# Altium schematic sheet UARTRecoder.SchDoc
size A3
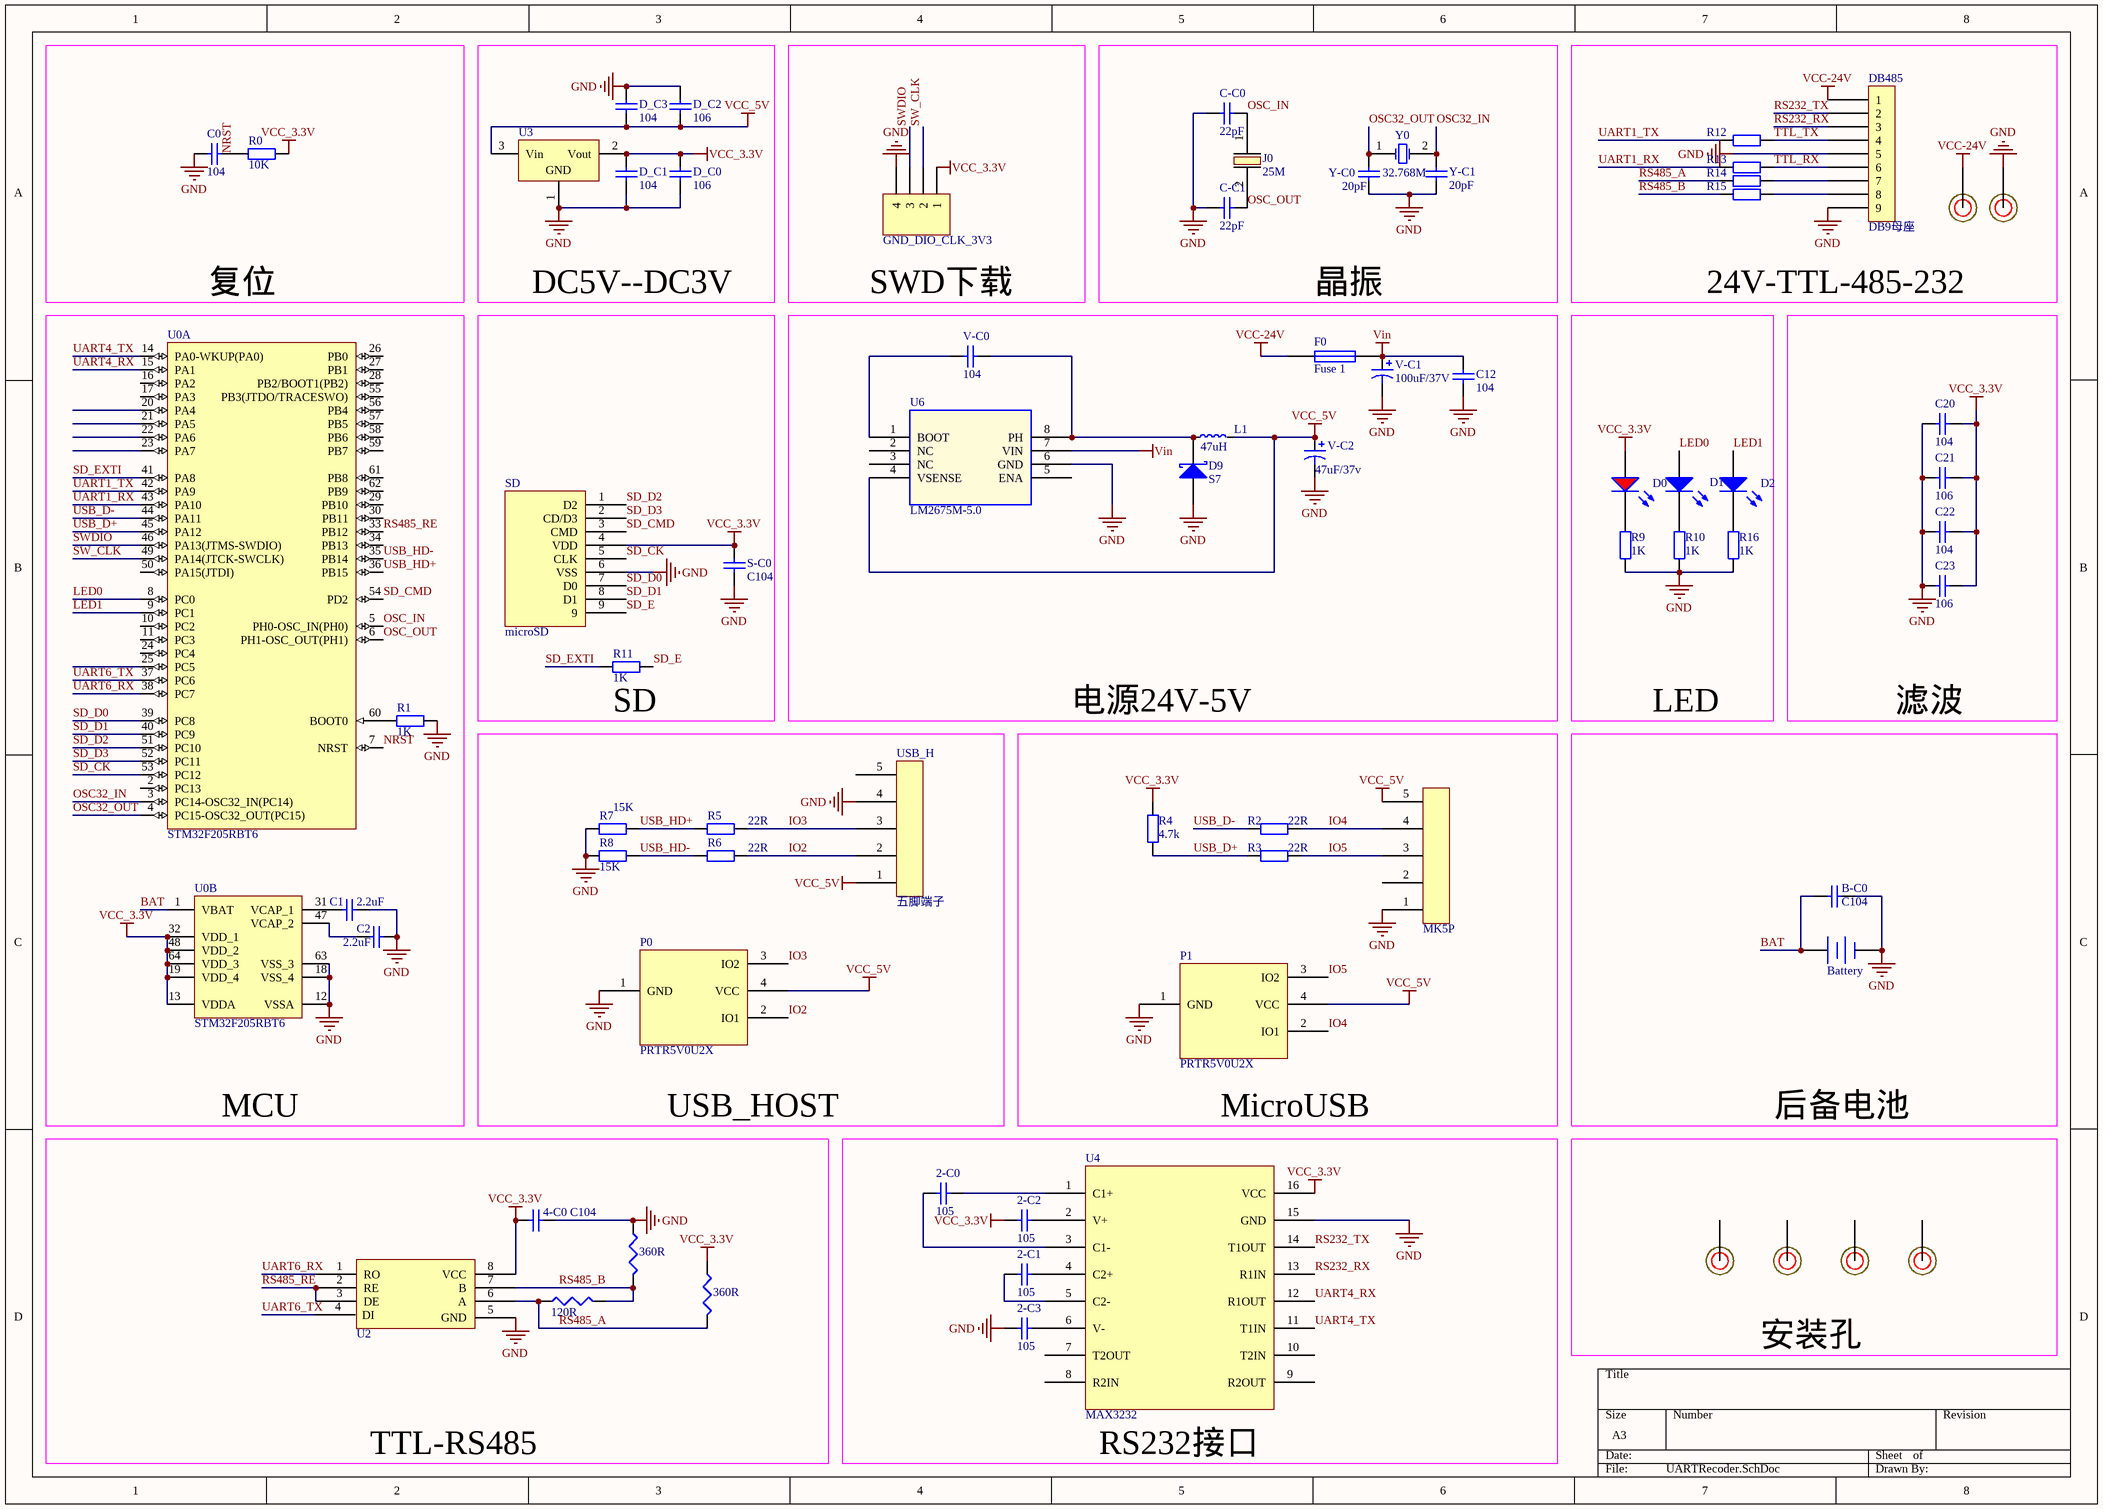
[diagram p0: UARTRecoder.SchDoc]

## Parts
2-C0  105  [C-RAD-0805]
2-C1  105  [C-RAD-0805]
2-C2  105  [C-RAD-0805]
2-C3  105  [C-RAD-0805]
4-C0  C104  [C-RAD-0805]
4-R0  value 360R  [R2012-0805]  (hidden comment: R360)
4-R1  value 360R  [R2012-0805]  (hidden comment: R360)
4-R2  value 120R  [R2012-0805]  (hidden comment: R120)
24V  1孔  [HOLEx1]  (value not drawn)
B-C0  C104  [C-RAD-0805]
bat  Battery  [BATM]
C0  104  [C-RAD-0805]
C1  2.2uF  [C-RAD-0805]
C2  2.2uF  [C-RAD-0805]
C12  104  [C-RAD-0805]
C20  104  [C-RAD-0805]
C21  106  [C-RAD-0805]
C22  104  [C-RAD-0805]
C23  106  [C-RAD-0805]
C-C0  22pF  [C-RAD-0805]
C-C1  22pF  [C-RAD-0805]
D0  Rled  [0805_LED_S1]  (value not drawn)
D1  Bled  [0805_LED_S1]  (value not drawn)
D2  Bled  [0805_LED_S1]  (value not drawn)
D9  S7  [SOD123]
D_C0  106  [C-RAD-0805]
D_C1  104  [C-RAD-0805]
D_C2  106  [C-RAD-0805]
D_C3  104  [C-RAD-0805]
DB485  DB9母座  [DB9-F]
EGND0  1孔  [HOLEx1]  (value not drawn)
EGND1  1孔  [HOLEx1]  (value not drawn)
EGND2  1孔  [HOLEx1]  (value not drawn)
EGND3  1孔  [HOLEx1]  (value not drawn)
F0  Fuse 1  [1812]
GND  1孔  [HOLEx1]  (value not drawn)
GND_DIO_CLK_3V3  Header 4  [HDR1X4]  (value not drawn)
J0  25M  [晶振HC-49S]
L1  47uH  [L-SMD-7]
MK5P  五脚端子  [USB-MICRO1]  (value not drawn)
P0  PRTR5V0U2X  [SOT-143]
P1  PRTR5V0U2X  [SOT-143]
R0  10K  [R2012-0805]
R1  1K  [R2012-0805]
R2  22R  [R2012-0805]
R3  22R  [R2012-0805]
R4  4.7k  [R2012-0805]
R5  22R  [R2012-0805]
R6  22R  [R2012-0805]
R7  15K  [R2012-0805]
R8  15K  [R2012-0805]
R9  1K  [R2012-0805]
R10  1K  [R2012-0805]
R11  1K  [R2012-0805]
R12  1K  [R2012-0805]  (value not drawn)
R13  1K  [R2012-0805]  (value not drawn)
R14  1K  [R2012-0805]  (value not drawn)
R15  1K  [R2012-0805]  (value not drawn)
R16  1K  [R2012-0805]
S-C0  C104  [C-RAD-0805]
SD  microSD  [SDCARD_B]
U0  STM32F205RBT6  [LQFP-64]  (parts A,B of 2)
U2  485  [SOP8]  (value not drawn)
U3  AMS1117-3.3  [SOT-223]  (value not drawn)
U4  MAX3232  [SOP-16]
U6  LM2675M-5.0  [SOP8 - 3d]
USB_H  五脚端子  [USB]
V-C0  104  [C-RAD-0805]
V-C1  100uF/37V  [SMD-EC-F6.3]
V-C2  47uF/37v  [SMD-EC-F4]
Y0  32.768M  [XTAL32]
Y-C0  20pF  [C-RAD-0805]
Y-C1  20pF  [C-RAD-0805]

## Blocks framed on the sheet
复位: C0 R0
DC5V--DC3V: D_C0-D_C3 U3
SWD下载: GND_DIO_CLK_3V3
晶振: C-C0 C-C1 J0 Y0 Y-C0 Y-C1
24V-TTL-485-232: 24V DB485 GND R12-R15
MCU: C1 C2 R1 U0
SD: R11 S-C0 SD
电源24V-5V: C12 D9 F0 L1 U6 V-C0-V-C2
滤波: C20-C23
USB_HOST: P0 R5-R8 USB_H

## Nets
GND: 2-C3.1 4-C0.1 4-R1.1 B-C0.1 bat.2(-) C0.2 C1.2 C2.2 C12.2 C20.1 C21.1 C22.1 C23.1 C-C0.1 C-C1.1 D9.1(A) D_C0.1 D_C1.1 D_C2.2 D_C3.2 DB485.5 DB485.9 GND.1 GND_DIO_CLK_3V3.4 MK5P.1 P0.1(GND) P1.1(GND) R1.2 R7.2 R8.2 R9.1 R10.1 R16.1 S-C0.2 SD.6(VSS) U0.12(VSSA) U0.18(VSS_4) U0.63(VSS_3) U2.5(GND) U3.1(GND) U4.15(GND) U6.6(GND) USB_H.4 V-C1.2 V-C2.2 Y-C0.1 Y-C1.1
VCC-24V: 24V.1 DB485.1 F0.1
VCC_3.3V: 2-C2.1 4-C0.2 4-R0.1 C20.2 C21.2 C22.2 C23.2 D0.A D_C0.2 D_C1.2 GND_DIO_CLK_3V3.1 R0.1 R4.2 S-C0.1 SD.4(VDD) U0.13(VDDA) U0.19(VDD_4) U0.32(VDD_1) U0.48(VDD_2) U0.64(VDD_3) U2.8(VCC) U3.2(Vout) U4.16(VCC)
VCC_5V: D_C2.1 D_C3.1 L1.2 MK5P.5 P0.4(VCC) P1.4(VCC) U3.3(Vin) U6.4(VSENSE) USB_H.1 V-C2.1
Vin: C12.1 F0.2 U6.7(VIN) V-C1.1
BAT: B-C0.2 bat.1(+) U0.1(VBAT)
IO2: P0.2(IO1) R6.2 USB_H.2
IO3: P0.3(IO2) R5.2 USB_H.3
IO4: MK5P.4 P1.2(IO1) R2.2
IO5: MK5P.3 P1.3(IO2) R3.2
LED0: D1.A U0.8(PC0)
LED1: D2.A U0.9(PC1)
NRST: C0.1 R0.2 U0.7(NRST)
OSC32_IN: U0.3(PC14-OSC32_IN(PC14)) Y0.2(OSC2) Y-C1.2
OSC32_OUT: U0.4(PC15-OSC32_OUT(PC15)) Y0.1(OSC1) Y-C0.2
OSC_IN: C-C0.2 J0.1 U0.5(PH0-OSC_IN(PH0))
OSC_OUT: C-C1.2 J0.2 U0.6(PH1-OSC_OUT(PH1))
RS232_RX: DB485.3 U4.13(R1IN)
RS232_TX: DB485.2 U4.14(T1OUT)
RS485_A: 4-R0.2 4-R2.1 R14.2 U2.6(A)
RS485_B: 4-R1.2 4-R2.2 R15.2 U2.7(B)
RS485_RE: U0.33(PB12) U2.2(RE) U2.3(DE)
SD_CK: SD.5(CLK) U0.53(PC12)
SD_CMD: SD.3(CMD) U0.54(PD2)
SD_D0: SD.7(D0) U0.39(PC8)
SD_D1: SD.8(D1) U0.40(PC9)
SD_D2: SD.1(D2) U0.51(PC10)
SD_D3: SD.2(CD/D3) U0.52(PC11)
SD_E: R11.2 SD.9
SD_EXTI: R11.1 U0.41(PA8)
SW_CLK: GND_DIO_CLK_3V3.2 U0.49(PA14(JTCK-SWCLK))
SWDIO: GND_DIO_CLK_3V3.3 U0.46(PA13(JTMS-SWDIO))
TTL_RX: DB485.6 R13.1
TTL_TX: DB485.4 R12.1
UART1_RX: R13.2 U0.43(PA10)
UART1_TX: R12.2 U0.42(PA9)
UART4_RX: U0.15(PA1) U4.12(R1OUT)
UART4_TX: U0.14(PA0-WKUP(PA0)) U4.11(T1IN)
UART6_RX: U0.38(PC7) U2.1(RO)
UART6_TX: U0.37(PC6) U2.4(DI)
USB_D+: R3.1 R4.1 U0.45(PA12)
USB_D-: R2.1 U0.44(PA11)
USB_HD+: R5.1 R7.1 U0.36(PB15)
USB_HD-: R6.1 R8.1 U0.35(PB14)
Net2-C0_1: 2-C0.1 U4.3(C1-)
Net2-C0_2: 2-C0.2 U4.1(C1+)
Net2-C1_1: 2-C1.1 U4.5(C2-)
Net2-C1_2: 2-C1.2 U4.4(C2+)
Net2-C2_2: 2-C2.2 U4.2(V+)
Net2-C3_2: 2-C3.2 U4.6(V-)
NetC1_1: C1.1 U0.31(VCAP_1)
NetC2_1: C2.1 U0.47(VCAP_2)
NetD0_K: D0.K R9.2
NetD1_K: D1.K R10.2
NetD2_K: D2.K R16.2
NetD9_2: D9.2(K) L1.1 U6.8(PH) V-C0.2
NetDB485_7: DB485.7 R14.1
NetDB485_8: DB485.8 R15.1
NetR1_1: R1.1 U0.60(BOOT0)
NetU6_1: U6.1(BOOT) V-C0.1

Not connected (* = marked no-connect by the designer): EGND0 1; EGND1 1; EGND2 1; EGND3 1; MK5P 2; U0 2(PC13) 10(PC2) 11(PC3) 16(PA2) 17(PA3) 20(PA4) 21(PA5) 22(PA6) 23(PA7) 24(PC4) 25(PC5) 26(PB0) 27(PB1) 28(PB2/BOOT1(PB2)) 29(PB10) 30(PB11) 34(PB13) 50(PA15(JTDI)) 55(PB3(JTDO/TRACESWO)) 56(PB4) 57(PB5) 58(PB6) 59(PB7) 61(PB8) 62(PB9); U4 7(T2OUT) 8(R2IN) 9(R2OUT) 10(T2IN); U6 2(NC) 3(NC) 5(ENA); USB_H 5

## Notes on the sheet
- LED
- MicroUSB
- 后备电池
- 安装孔
- TTL-RS485
- (near U4) RS232接口

## Library data of the parts
2-C0-2-C3 = 0805 1uF (105) 10% 50V: 贴片电容; ComponentLink1Description: 供应商链接; ComponentLink1URL: http://www.szlcsc.com/product/details_29074.html; Package: 0805; Supplier: LC; SuppliersPartNumber: C28323
4-C0 B-C0 S-C0 = Cap Semi: Capacitor (Semiconductor SIM Model); Value: 104; Published: 8-Jun-2000; LatestRevisionDate: 17-Jul-2002; LatestRevisionNote: Re-released for DXP Platform.; PackageReference: C1206; Publisher: Altium Limited
4-R0-4-R2 = Res3: Resistor
bat = Battery: Multicell Battery; Published: 24-Mar-1999; LatestRevisionDate: 17-Jul-2002; LatestRevisionNote: Re-released for DXP Platform.; PackageReference: BAT-2; Publisher: Altium Limited
C0 D_C0-D_C3 V-C0 = 0805 100nF(104) 10% 50V: 贴片电容; ComponentLink1Description: 供应商链接; ComponentLink1URL: http://www.szlcsc.com/product/details_50686.html; Package: 0805; Supplier: LC; SuppliersPartNumber: C49678
C1 C2 = 0805 2.2uF (225) 20% 50V: 贴片电容; ComponentLink1Description: 供应商链接; ComponentLink1URL: http://www.szlcsc.com/product/details_50225.html; Package: 0805; Supplier: LC; SuppliersPartNumber: C49217
C12 C20-C23 = Cap: Capacitor; Value: 0.1uF; Published: 8-Jun-2000; LatestRevisionDate: 17-Jul-2002; LatestRevisionNote: Re-released for DXP Platform.; PackageReference: RAD-0.3; Publisher: Altium Limited
C-C0 C-C1 = 0603 22pF (220) 5% 50V: 贴片电容; ComponentLink1Description: 供应商链接; ComponentLink1URL: http://www.szlcsc.com/product/details_2005.html; Package: 0603; Supplier: LC; SuppliersPartNumber: C1653
D0 = 0805 红灯: 发光二极管; ComponentLink1Description: 供应商链接; ComponentLink1URL: http://www.szlcsc.com/product/details_2668.html; Package: 0805; Supplier: LC; SuppliersPartNumber: C2295
D1 D2 = 0805 蓝灯: 发光二极管; ComponentLink1Description: 供应商链接; ComponentLink1URL: http://www.szlcsc.com/product/details_2666.html; Package: 0805; Supplier: LC; SuppliersPartNumber: C2293
D9 = D Schottky: Schottky Diode; Published: 8-Jun-2000; LatestRevisionDate: 17-Jul-2002; LatestRevisionNote: Re-released for DXP Platform.; PackageReference: SMB; Publisher: Altium Limited; Code_JEDEC: DO-214-AA
DB485 = 9脚封装DB9
F0 = Fuse 1: Fuse; Published: 8-Jun-2000; LatestRevisionDate: 17-Jul-2002; LatestRevisionNote: Re-released for DXP Platform.; PackageReference: PIN-W2/E2.8; Publisher: Altium Limited
GND_DIO_CLK_3V3 = Header 4: Header, 4-Pin; LatestRevisionDate: 17-Jul-2002; LatestRevisionNote: Re-released for DXP Platform.; Publisher: Altium Limited
J0 = 晶振
L1 = Lnductor
R0 R2-R10 R12-R16 = 0805 1KΩ (1001) 1%: 贴片电阻; ComponentLink1Description: 供应商链接; ComponentLink1URL: http://www.szlcsc.com/product/details_18201.html; Package: 0805; Supplier: LC; SuppliersPartNumber: C17513
R1 R11 = 0603 1KΩ (1001) 1%: 贴片电阻; ComponentLink1Description: 供应商链接; ComponentLink1URL: http://www.szlcsc.com/product/details_21904.html; Package: 0603; Supplier: LC; SuppliersPartNumber: C21190
U0 = STM32F205RBT6: ARM Cortex-M3 32-bit MCU, 128 KB Flash, 64 KB Internal RAM, 51 I/Os, 64-pin LQFP, -40 to 85 degC, Tray; D/A Converter: 2x12-bit (2 Channel); FLASH Size (Prog) (kB): 128; I/Os (High Current): 51; Internal RAM Size (kB): 64; Operating Frequency(F) (Processor speed) (MHz): 120; Supply Voltage(Vcc) min (V): 1.8; DatasheetVersion: Rev. 9; PackageVersion: Rev. 4, 06/2013; PackageReference: LQFP64; PackageDescription: 64-Pin Low Profile Quad Flat Package, 10 x 10 mm Body, 0.5 mm Pitch; Supplier 1: Digi-Key; Supplier Part Number 1: 497-11153-ND; Supplier 2: Farnell; Supplier Part Number 2: 2060895; Supplier 3: Newark; Supplier Part Number 3: 47T9327; Core: ARM Cortex-M3; Packing: Tray; Mounting Technology: Surface Mount; PartNumber: STM32F205RBT6; ComponentLink1Description: Manufacturer URL; ComponentLink1URL: http://www.st.com/web/en/home.html; ComponentLink2Description: Datasheet; ComponentLink2URL: http://www.st.com/st-web-ui/static/active/en/resource/technical/document/datasheet/CD00237391.pdf; ComponentLink3Description: Package Specification; ComponentLink3URL: http://www.st.com/st-web-ui/static/active/en/resource/technical/document/datasheet/DM00037051.pdf
U2 = SP3485
U3 = SOT-223 AMS1117-3.3: 低压差线性稳压(LDO); ComponentLink1Description: 供应商链接; ComponentLink1URL: http://www.szlcsc.com/product/details_6652.html; Package: SOT-223; Supplier: LC; SuppliersPartNumber: C6186
U6 = TPS5410
V-C1 = Cap Pol3: Polarized Capacitor (Surface Mount); Value: 25V/100uF; Published: 8-Jun-2000; LatestRevisionDate: 17-Jul-2002; LatestRevisionNote: Re-released for DXP Platform.; PackageReference: C0805; Publisher: Altium Limited
V-C2 = Cap Pol3: Polarized Capacitor (Surface Mount); Value: 10V/10uF; Published: 8-Jun-2000; LatestRevisionDate: 17-Jul-2002; LatestRevisionNote: Re-released for DXP Platform.; PackageReference: C0805; Publisher: Altium Limited
Y0 = XTAL: Crystal Oscillator; Published: 8-Jun-2000; LatestRevisionDate: 17-Jul-2002; LatestRevisionNote: Re-released for DXP Platform.; PackageReference: R38; Publisher: Altium Limited
Y-C0 Y-C1 = 0805 20pF (200) 5% 50V: 贴片电容; ComponentLink1Description: 供应商链接; ComponentLink1URL: http://www.szlcsc.com/product/details_2150.html; Package: 0805; Supplier: LC; SuppliersPartNumber: C1798